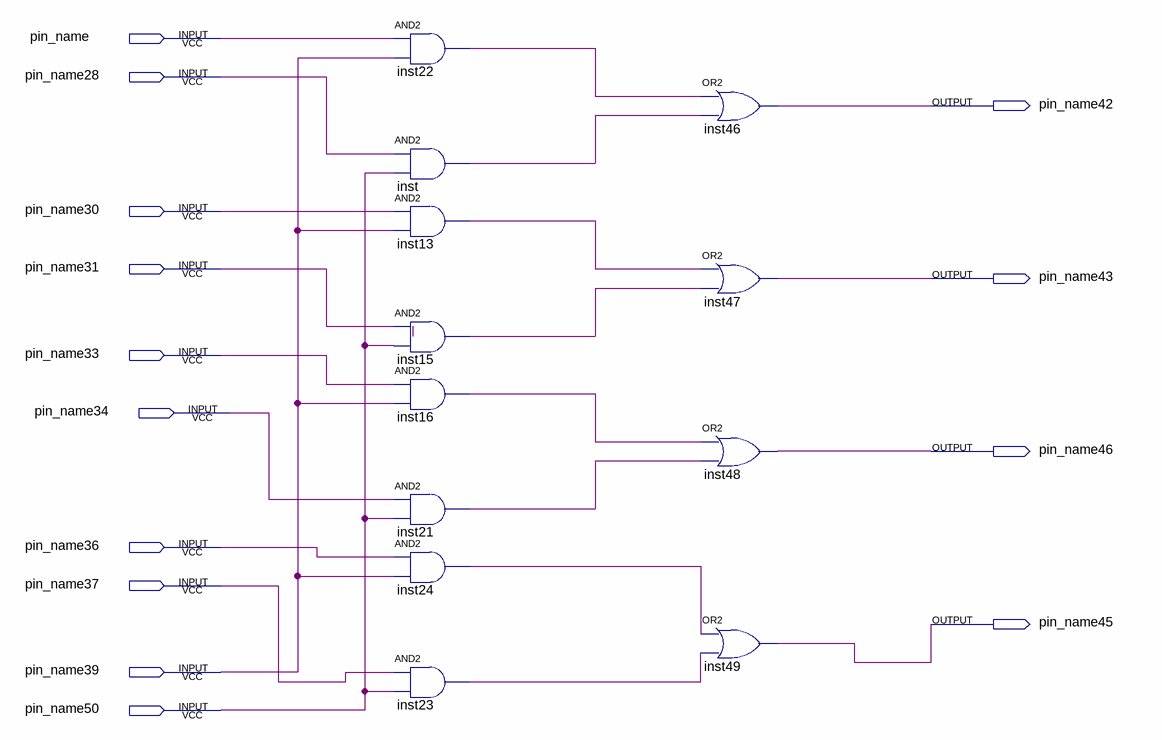
[diagram p0: schematic sheet]
// Quartus schematic selector.bdf as structural Verilog: 12 symbols, 14 pins
module selector (
  input  pin_name,
  input  pin_name28,
  input  pin_name30,
  input  pin_name31,
  input  pin_name33,
  input  pin_name34,
  input  pin_name36,
  input  pin_name37,
  input  pin_name39,
  input  pin_name50,
  output pin_name42,
  output pin_name43,
  output pin_name46,
  output pin_name45
);

  wire inst13_out, inst15_out, inst16_out, inst21_out, inst22_out, inst23_out, inst24_out, inst_out;

  and inst22 (inst22_out, pin_name, pin_name39);
  and inst (inst_out, pin_name28, pin_name50);
  and inst13 (inst13_out, pin_name30, pin_name39);
  and inst15 (inst15_out, pin_name31, pin_name50);
  and inst16 (inst16_out, pin_name33, pin_name39);
  and inst21 (inst21_out, pin_name34, pin_name50);
  and inst24 (inst24_out, pin_name36, pin_name39);
  and inst23 (inst23_out, pin_name37, pin_name50);
  or inst46 (pin_name42, inst22_out, inst_out);
  or inst47 (pin_name43, inst13_out, inst15_out);
  or inst48 (pin_name46, inst16_out, inst21_out);
  or inst49 (pin_name45, inst24_out, inst23_out);
endmodule
